# EasyEDA Pro project PCB.epro

# Schematic Schematic1
Board Name: Board1; Create Date: 2025-07-06; Page Name: P1; Project Name: test; Schematic Name: Schematic1; Update Date: 2025-07-06; Company: EasyEDA.com; Page Size: A4; Version: V1.0
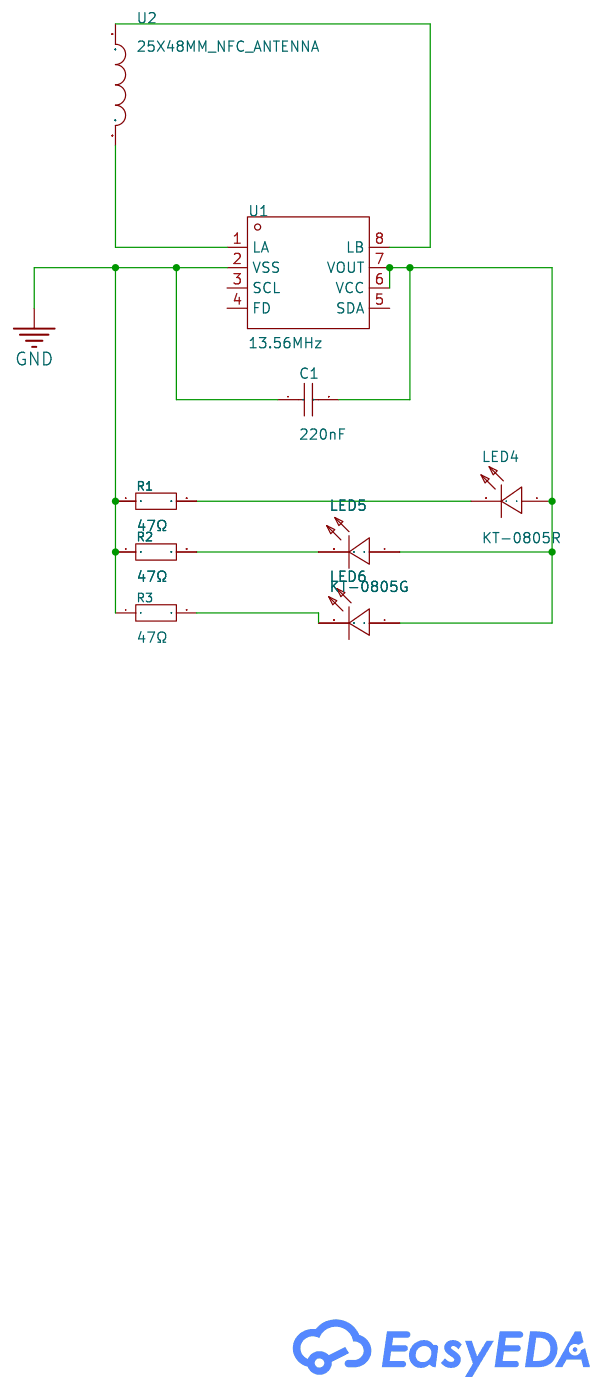
[diagram p0: schematic sheet]

## Parts
C1  220nF  [C0603]
LED4  KT-0805R  [LED0805-R-RD]
LED5  KT-0805G  [LED0805-R-RD]
LED6  KT-0805B  [LED0805-R-RD]
R1  47Ω  [R0603]
R2  47Ω  [R0603]
R3  47Ω  [R0603]
U1  13.56MHz  [XQFN-8_L1.6-W1.6-P0.50-BL_NT3H2111W0FHKH]
U2  25X48MM_NFC_ANTENNA  [25X48MM_NFC_ANTENNA]

## Library data of the parts
C1 = CL10B224KA8NNNC: Capacitance: Tolerance:±10% Tolerance:±10% Voltage Rated: Temperature Coefficient:; LCSC Part Name: 220nF ±10% 25V; Supplier Part: C21120; Manufacturer: SAMSUNG(三星); Supplier Footprint: 0603; JLCPCB Part Class: Basic Part; Datasheet: https://atta.szlcsc.com/upload/public/pdf/source/20160218/1457707763339.pdf; Supplier: LCSC; Tolerance: ±10%
LED4 = KT-0805R: LCSC Part Name: 0805 红灯 高亮; Supplier Part: C2295; Manufacturer: KENTO; Supplier Footprint: 0805; JLCPCB Part Class: Extended Part; Supplier: LCSC
LED5 = KT-0805G: Lamp Holder Type:- Emitted Color:Emerald Forward Voltage (VF):- Forward Voltage (VF):- Power Dissipation:- Forward Current:- Dominant Wavelength:- Dominant Wavelength:- Peak Wavelength:- Diode Configuration:- Lens Color:- Color Temperature:- Color Tempera; LCSC Part Name: 0805 翠绿 高亮; Supplier Part: C2297; Manufacturer: KENTO; Supplier Footprint: 0805; JLCPCB Part Class: Basic Part; Datasheet: https://atta.szlcsc.com/upload/public/pdf/source/20170209/1486607340485.pdf; Supplier: LCSC; Emitted Color: Emerald
LED6 = KT-0805B: LCSC Part Name: 0805 蓝灯 高亮; Supplier Part: C2293; Manufacturer: KENTO; Supplier Footprint: 0805; JLCPCB Part Class: Extended Part; Datasheet: https://atta.szlcsc.com/upload/public/pdf/source/20150723/1457707334170.pdf; Supplier: LCSC
R1-R3 = 0603WAF470JT5E: Type:Thick Film Resistors Resistance:47Ω Tolerance:±1% Tolerance:±1% Power(Watts): Overload Voltage (Max): Temperature Coefficient:±100ppm/℃ Temperature Coefficient:±100ppm/℃ Operating Temperature Range:-55℃~+155℃ Operating Temperature Range:-55℃~+155℃; LCSC Part Name: 47Ω ±1% 100mW 厚膜电阻; Supplier Part: C23182; Manufacturer: UNI-ROYAL(厚声); Supplier Footprint: 0603; JLCPCB Part Class: Basic Part; Datasheet: https://atta.szlcsc.com/upload/public/pdf/source/20200306/C422600_1E6D84923E4A46A82E41ADD87F860B5C.pdf; Supplier: LCSC; Type: Thick Film Resistors; Tolerance: ±1%; Temperature Coefficient: ±100ppm/℃; Operating Temperature Range: -55℃~+155℃
U1 = NT3H2111W0FHKH: agreement:ISO 14443 interface type:I2C Frequency:13.56MHz Frequency:13.56MHz mains input:3.3V mains input:3.3V; Supplier Part: C710403; Manufacturer: NXP(恩智浦); Supplier Footprint: XQFN-8(1.6x1.6); JLCPCB Part Class: Extended Part; Datasheet: https://www.nxp.com/docs/en/data-sheet/NT3H2111_2211.pdf; Supplier: LCSC; agreement: ISO 14443; interface type: I2C; mains input: 3.3V
U2 = 25X48MM_NFC_ANTENNA

## Nets
GND: C1.1 R1.1 R2.1 R3.1 U1.2(VSS)
$1N423: C1.2 LED4.1(A) LED5.1(A) LED6.1(A) U1.6(VCC) U1.7(VOUT)
$1N436: U1.1(LA) U2.P$2
$1N444: U1.8(LB) U2.P$1
$1N551: LED4.2(K) R1.2
$1N976: LED6.2(K) R3.2
$1N1013: LED5.2(K) R2.2

Not connected (* = marked no-connect by the designer): U1 3(SCL) 4(FD) 5(SDA)

# Board PCB2
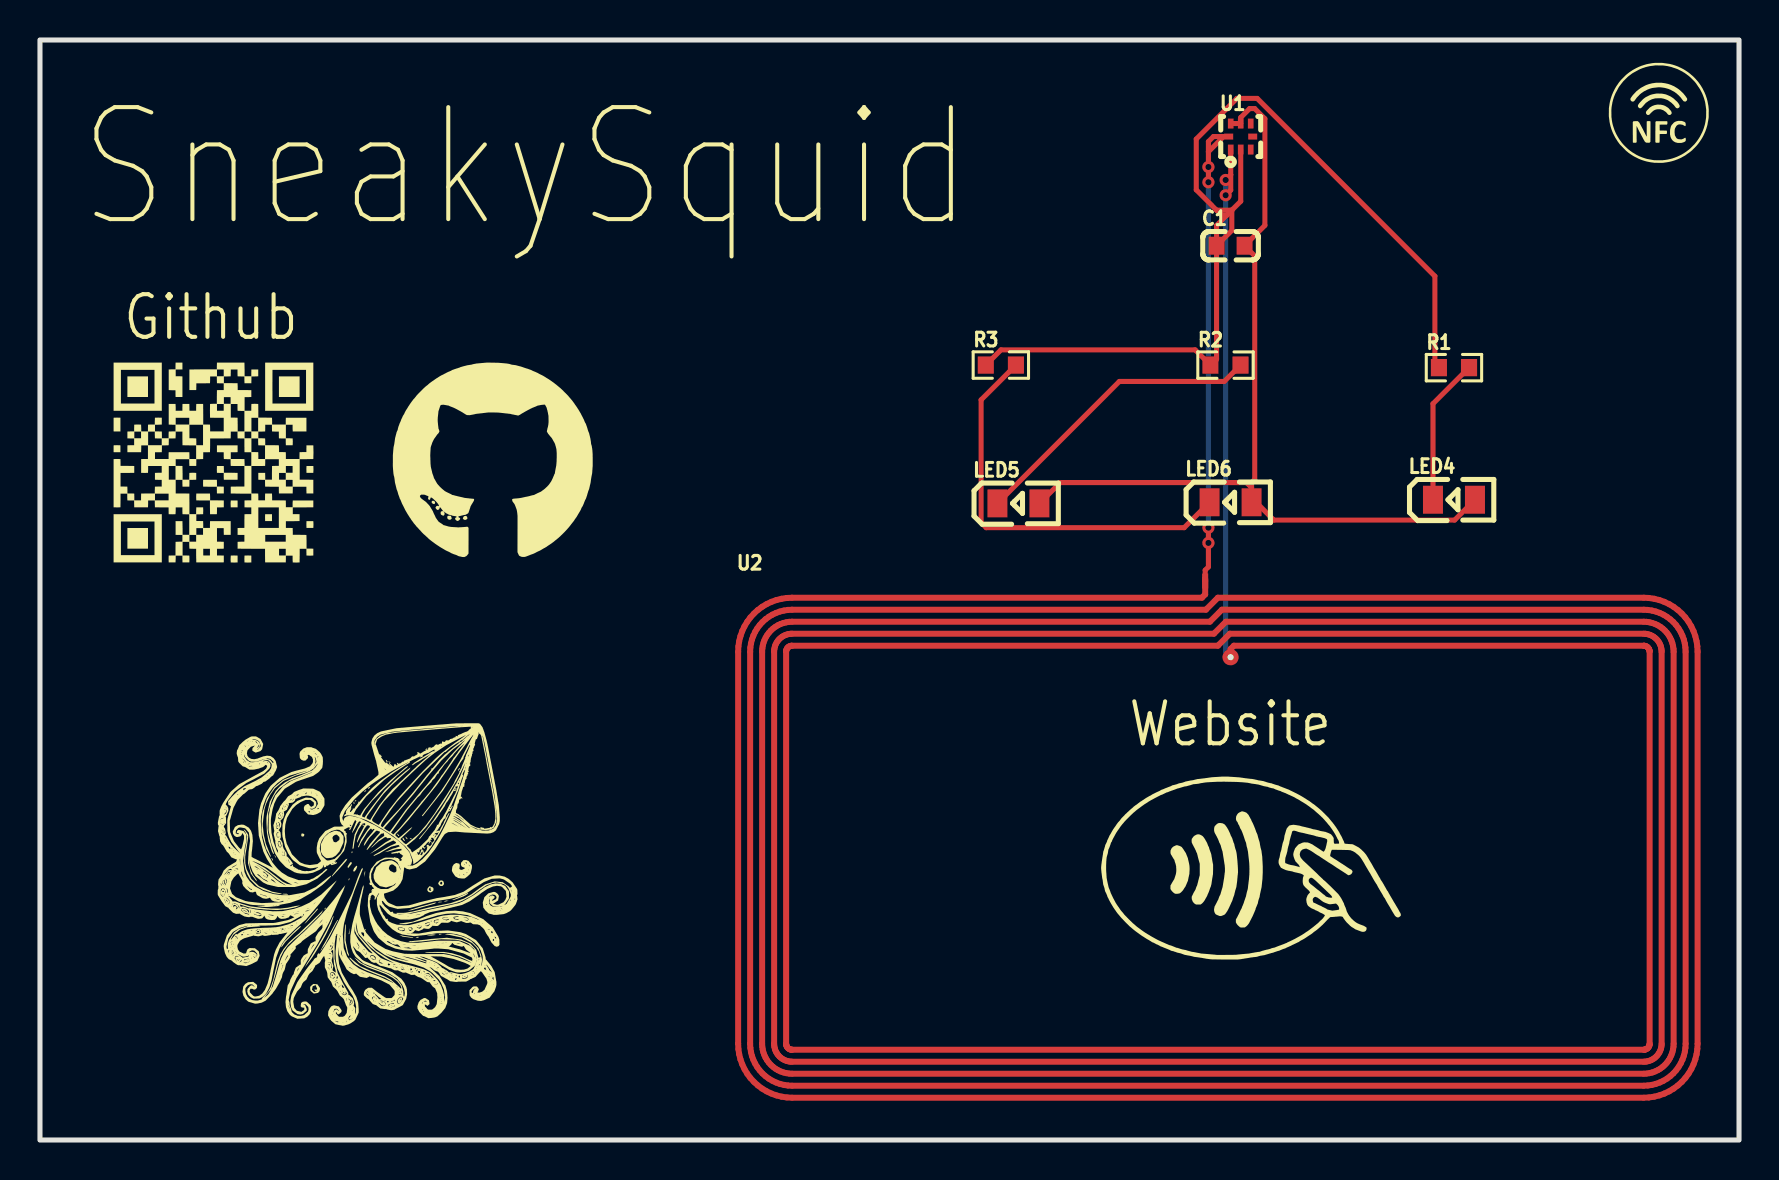
[diagram p1: board, top side]
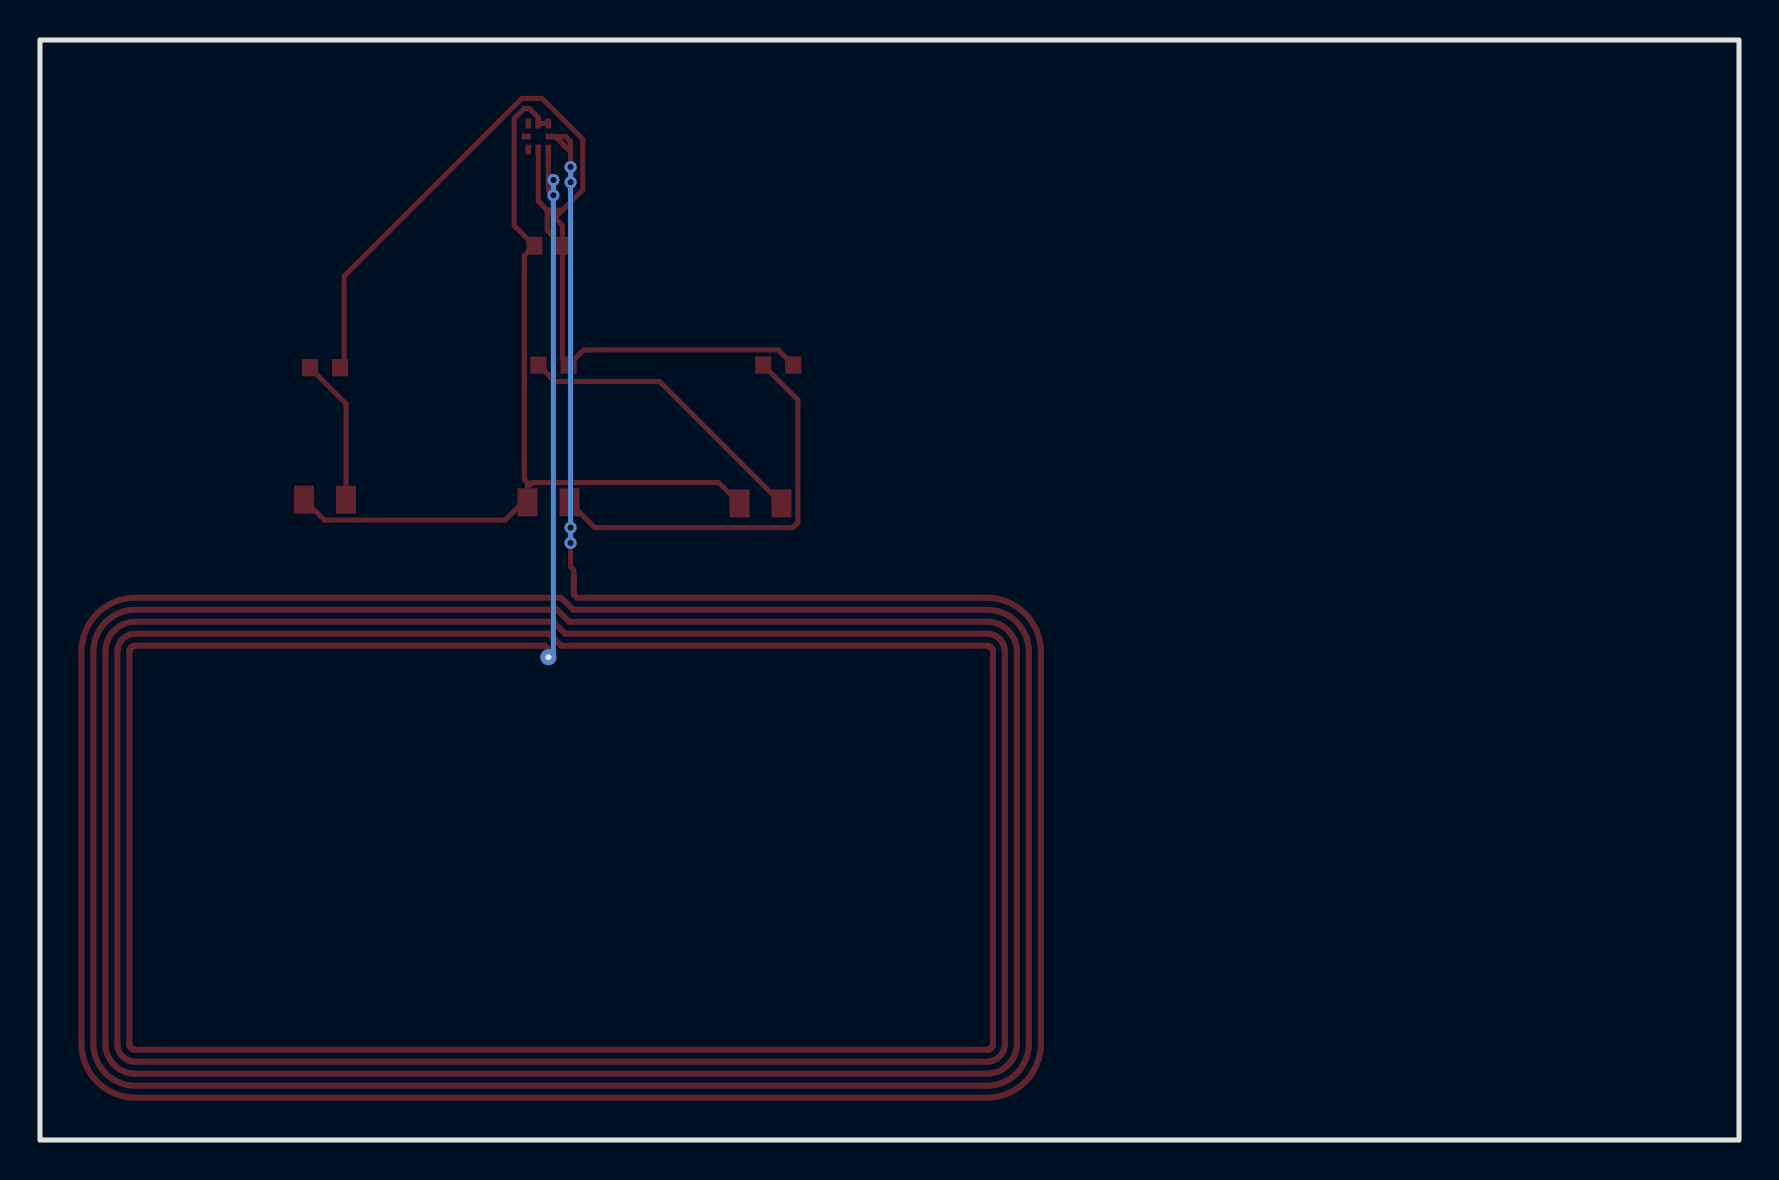
[diagram p2: board, bottom side, seen from below]

Outline 85 x 55 mm; copper layers: Top Layer, Bottom Layer. Coordinates in mm from the lower left corner of the outline.
Outline path: rectangle 0,55 85,0
Stack: Top Layer 0.035mm / Dielectric1 1.51mm FR4 er 4.5 / Bottom Layer 0.035mm

## Design rules (mm)
template: JLCPCB Capability(Two Layers Board)
spacing copperThickness1oz (default): track to track 0.102, other pairs 0.152 to 0.3
spacing copperThickness2oz: track to track 0.203, other pairs 0.152 to 0.3
track width copperThickness1oz (default): min 0.127, default 0.254, max 2.54
track width copperThickness2oz: min 0.203, default 0.254, max 2.54
differential pair differentialPair (default): width min 0.127, default 0.254, max 2.54; gap min 0.152, default 0.152
via viaSize (default): diameter min 0.5, default 0.61, max 10; hole min 0.3, default 0.305, max 6.3

## Placement (name value [footprint] x y rotation side)
C1  220nF  [C0603]  59.56 44.71 0 top
LED4  KT-0805R  [LED0805-R-RD]  70.74 32.01 0 top
LED5  KT-0805G  [LED0805-R-RD]  48.95 31.83 0 top
LED6  KT-0805B  [LED0805-R-RD]  59.56 31.89 0 top
R1  47Ω  [R0603]  70.74 38.62 0 top
R2  47Ω  [R0603]  59.31 38.74 0 top
R3  47Ω  [R0603]  48.07 38.75 0 top
U1  13.56MHz  [XQFN-8_L1.6-W1.6-P0.50-BL_NT3H2111W0FHKH]  60.07 50.17 0 top
U2  -  [25X48MM_NFC_ANTENNA]  58.93 14.61 0 top

## Footprints (pads in the part's own frame, mm; a bottom-side part is the same pattern mirrored in y, then rotated)
25X48MM_NFC_ANTENNA
  rect 0.3x0.75 smd: P$1(-0.635,13.335)
  round 0.808 hole 0.3: P$2(0.635,9.525)
C0603
  rect 0.8x0.9 smd: 1(-0.7,0) 2(0.7,0)
LED0805-R-RD
  rect 1x1.399 smd: 1(1.05,0) 2(-1.05,0)
R0603
  rect 0.806x0.864 smd: 1(-0.753,0) 2(0.753,0)
XQFN-8_L1.6-W1.6-P0.50-BL_NT3H2111W0FHKH
  rect 0.28x0.5 smd: 1(-0.5,-0.65) 2(0,-0.65) 3(0.5,-0.65) 5(0.5,0.65) 6(0,0.65) 7(-0.5,0.65)
  rect 0.45x0.3 smd: 4(0.6,0) 8(-0.6,0)

## Nets
As in the schematic.

Pads without a net: U1 3 4 5

## Via types
v1: diameter 0.61, hole 0.305, Top Layer to Bottom Layer, 6 vias

## Routing (per net, layer and track width the routed paths; a pad name or vN(x,y) marks a point on that pad's centre or on a via; arc(x,y) is an arc through that point)
GND: length 51.8
  Top Layer w0.254: 59.62,46.49 58.86,46.49 ; 59.62,46.49 59.62,45.48 C1.1 ; 59.62,46.49 60.07,46.94 U1.2 ; 59.62,46.49 59.37,46.24 ; 58.86,46.49 57.85,47.51 57.85,50.05 59.88,52.08 60.89,52.08 69.79,43.19 69.79,38.82 R1.1 ; 58.86,46.49 59.12,46.24 59.37,46.24 ; C1.1 58.86,45.73 59.37,46.24 ; C1.1 58.86,39.05 R2.1 57.79,39.51 48.08,39.51 R3.1
$1N423: length 45.5
  Top Layer w0.254: 60.61,32.11 61.73,31 70.77,31 LED4.1 ; 60.61,32.11 60.61,32.62 ; 60.61,32.11 LED6.1 ; LED5.1 51.04,32.87 60.36,32.87 60.61,32.62 ; 60.61,32.62 60.61,32.87 60.77,33.03 60.77,44.21 C1.2 61.28,45.73 61.28,51.06 60.77,51.57 60.52,51.57 60.07,51.13 U1.6 U1.7
$1N436: length 26.7
  Top Layer w0.254: U1.1 59.57,48.25 ; 59.57,48.25 v1(59.32,48) ; 59.57,48.25 59.57,47.49 v1(59.32,47.24)
  Bottom Layer w0.254: U2.P$2 59.32,24.39 v1(59.32,47.24) v1(59.32,48)
$1N444: length 25.8
  Top Layer w0.254: U2.P$1 58.29,28.49 58.45,28.65 v1(58.45,29.85) v1(58.45,30.62) ; 59.22,50.17 58.71,50.17 58.45,49.92 58.45,49.41 ; 59.22,50.17 U1.8 ; 59.22,50.17 58.45,49.41 ; 58.45,49.41 v1(58.45,48.65) v1(58.45,47.89)
  Bottom Layer w0.254: v1(58.45,48.65) v1(58.45,47.89) v1(58.45,30.62) v1(58.45,29.85)
$1N551: length 7.4
  Top Layer w0.254: R1.2 69.69,36.81 LED4.2
$1N976: length 20.7
  Top Layer w0.254: R3.2 47.08,37.01 47.08,30.87 47.34,30.62 57.24,30.62 LED6.2
$1N1013: length 15
  Top Layer w0.254: LED5.2 54,37.93 59.25,37.93 R2.2

## Text on the board
Top Silkscreen Layer: Website | Github | SneakySquid
